# EAGLE schematic damballah_testboard (EAGLE 5.10)
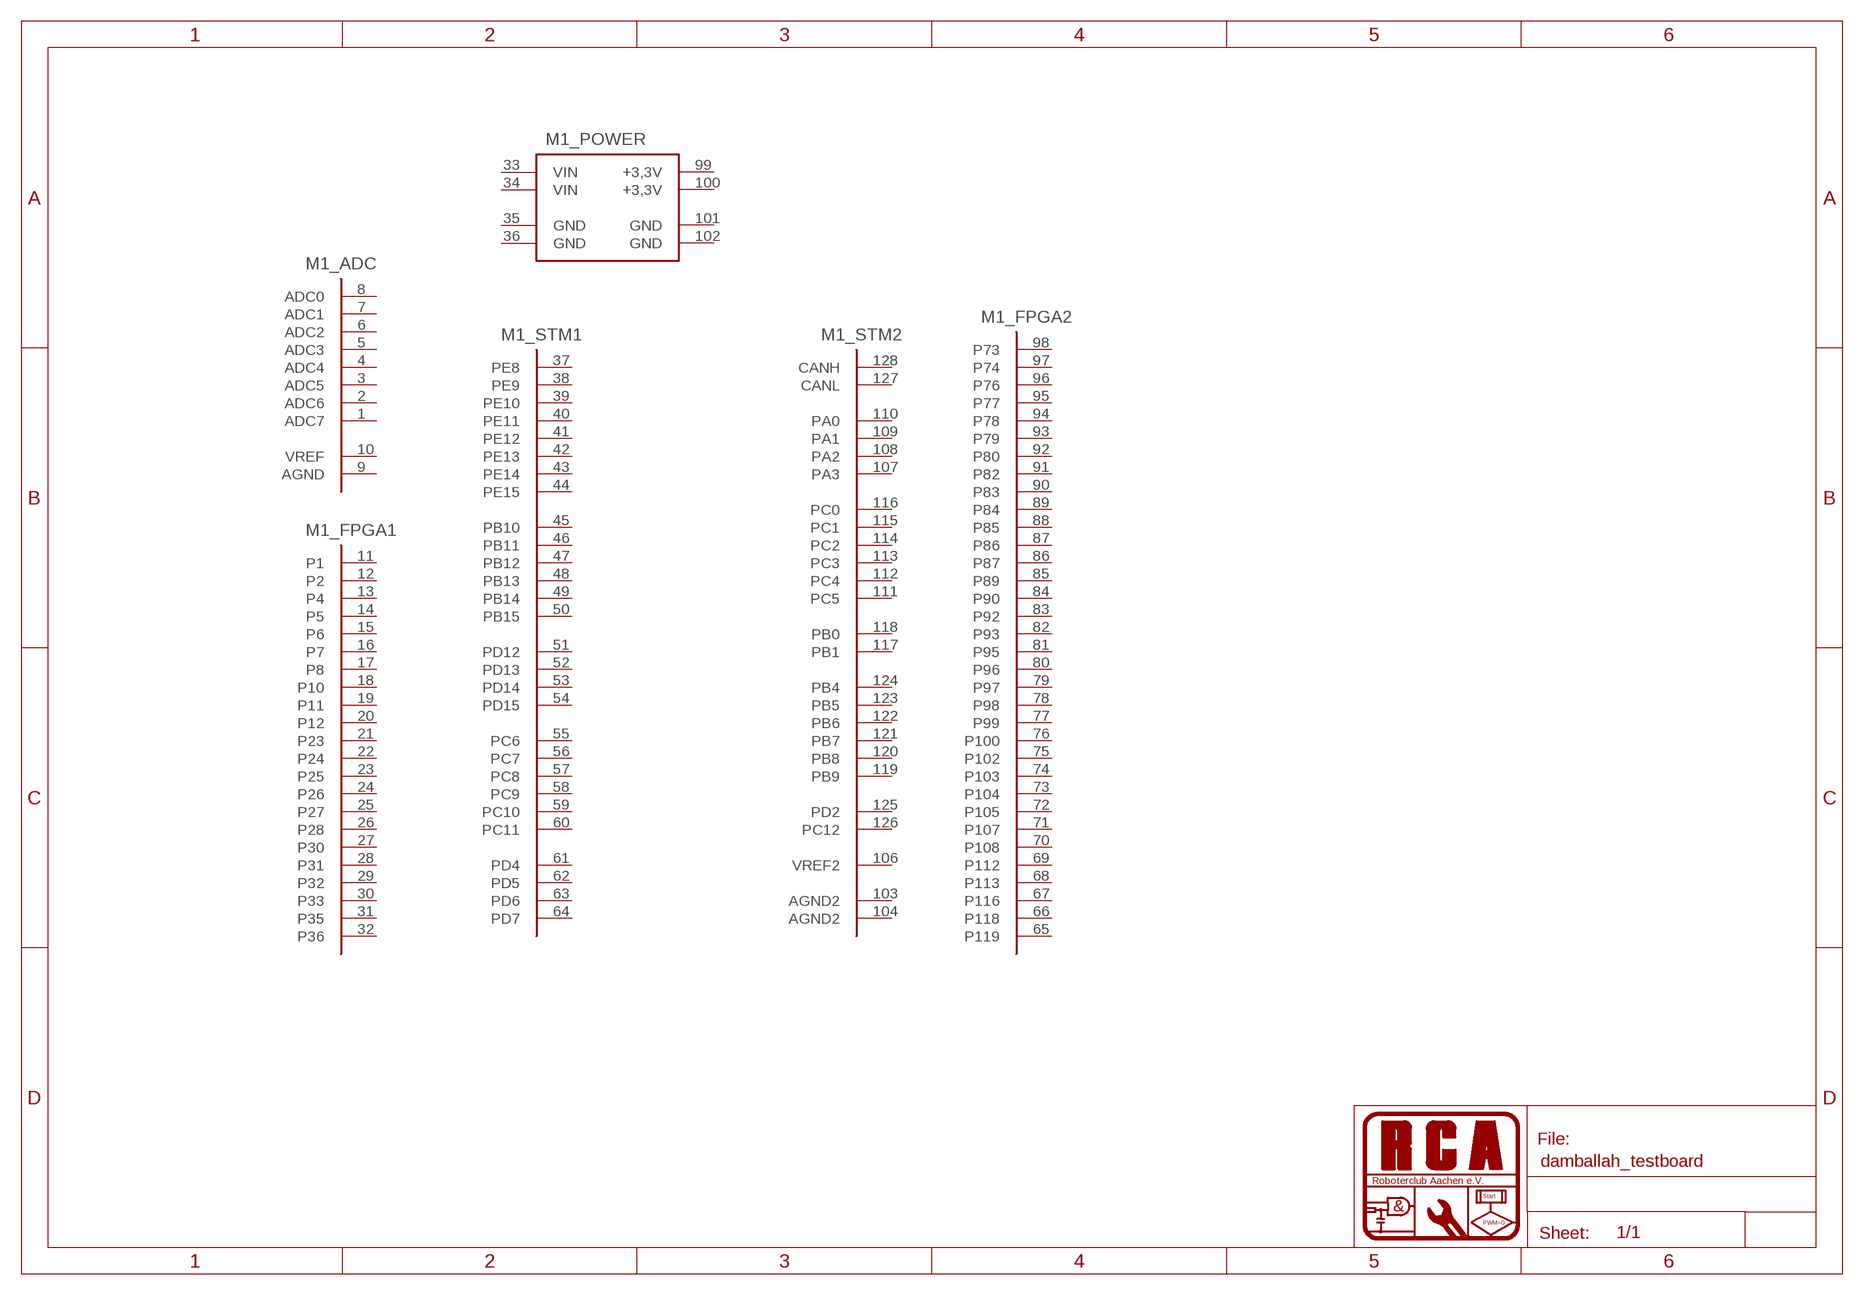
[diagram p0: schematic, sheet 1]

## Parts
M1  DAMBALLAH  [CONTROL]
Unconnected: M1.1(_ADC:ADC7) M1.2(_ADC:ADC6) M1.3(_ADC:ADC5) M1.4(_ADC:ADC4) M1.5(_ADC:ADC3) M1.6(_ADC:ADC2) M1.7(_ADC:ADC1) M1.8(_ADC:ADC0) M1.9(_ADC:AGND) M1.10(_ADC:VREF) M1.11(_FPGA1:P1) M1.12(_FPGA1:P2) M1.13(_FPGA1:P4) M1.14(_FPGA1:P5) M1.15(_FPGA1:P6) M1.16(_FPGA1:P7) M1.17(_FPGA1:P8) M1.18(_FPGA1:P10) M1.19(_FPGA1:P11) M1.20(_FPGA1:P12) M1.21(_FPGA1:P23) M1.22(_FPGA1:P24) M1.23(_FPGA1:P25) M1.24(_FPGA1:P26) M1.25(_FPGA1:P27) M1.26(_FPGA1:P28) M1.27(_FPGA1:P30) M1.28(_FPGA1:P31) M1.29(_FPGA1:P32) M1.30(_FPGA1:P33) M1.31(_FPGA1:P35) M1.32(_FPGA1:P36) M1.33(_POWER:VIN) M1.34(_POWER:VIN) M1.35(_POWER:GND) M1.36(_POWER:GND) M1.37(_STM1:PE8) M1.38(_STM1:PE9) M1.39(_STM1:PE10) M1.40(_STM1:PE11) M1.41(_STM1:PE12) M1.42(_STM1:PE13) M1.43(_STM1:PE14) M1.44(_STM1:PE15) M1.45(_STM1:PB10) M1.46(_STM1:PB11) M1.47(_STM1:PB12) M1.48(_STM1:PB13) M1.49(_STM1:PB14) M1.50(_STM1:PB15) M1.51(_STM1:PD12) M1.52(_STM1:PD13) M1.53(_STM1:PD14) M1.54(_STM1:PD15) M1.55(_STM1:PC6) M1.56(_STM1:PC7) M1.57(_STM1:PC8) M1.58(_STM1:PC9) M1.59(_STM1:PC10) M1.60(_STM1:PC11) M1.61(_STM1:PD4) M1.62(_STM1:PD5) M1.63(_STM1:PD6) M1.64(_STM1:PD7) M1.65(_FPGA2:P119) M1.66(_FPGA2:P118) M1.67(_FPGA2:P116) M1.68(_FPGA2:P113) M1.69(_FPGA2:P112) M1.70(_FPGA2:P108) M1.71(_FPGA2:P107) M1.72(_FPGA2:P105) M1.73(_FPGA2:P104) M1.74(_FPGA2:P103) M1.75(_FPGA2:P102) M1.76(_FPGA2:P100) M1.77(_FPGA2:P99) M1.78(_FPGA2:P98) M1.79(_FPGA2:P97) M1.80(_FPGA2:P96) M1.81(_FPGA2:P95) M1.82(_FPGA2:P93) M1.83(_FPGA2:P92) M1.84(_FPGA2:P90) M1.85(_FPGA2:P89) M1.86(_FPGA2:P87) M1.87(_FPGA2:P86) M1.88(_FPGA2:P85) M1.89(_FPGA2:P84) M1.90(_FPGA2:P83) M1.91(_FPGA2:P82) M1.92(_FPGA2:P80) M1.93(_FPGA2:P79) M1.94(_FPGA2:P78) M1.95(_FPGA2:P77) M1.96(_FPGA2:P76) M1.97(_FPGA2:P74) M1.98(_FPGA2:P73) M1.99(_POWER:+3,3V) M1.100(_POWER:+3,3V) M1.101(_POWER:GND) M1.102(_POWER:GND) M1.103(_STM2:AGND2) M1.104(_STM2:AGND2) M1.106(_STM2:VREF2) M1.107(_STM2:PA3) M1.108(_STM2:PA2) M1.109(_STM2:PA1) M1.110(_STM2:PA0) M1.111(_STM2:PC5) M1.112(_STM2:PC4) M1.113(_STM2:PC3) M1.114(_STM2:PC2) M1.115(_STM2:PC1) M1.116(_STM2:PC0) M1.117(_STM2:PB1) M1.118(_STM2:PB0) M1.119(_STM2:PB9) M1.120(_STM2:PB8) M1.121(_STM2:PB7) M1.122(_STM2:PB6) M1.123(_STM2:PB5) M1.124(_STM2:PB4) M1.125(_STM2:PD2) M1.126(_STM2:PC12) M1.127(_STM2:CANL) M1.128(_STM2:CANH)

## Library data of the parts
M1 = loa:DAMBALLAH